# EAGLE board Keyboard (EAGLE 8.1.1), part 1 of 18
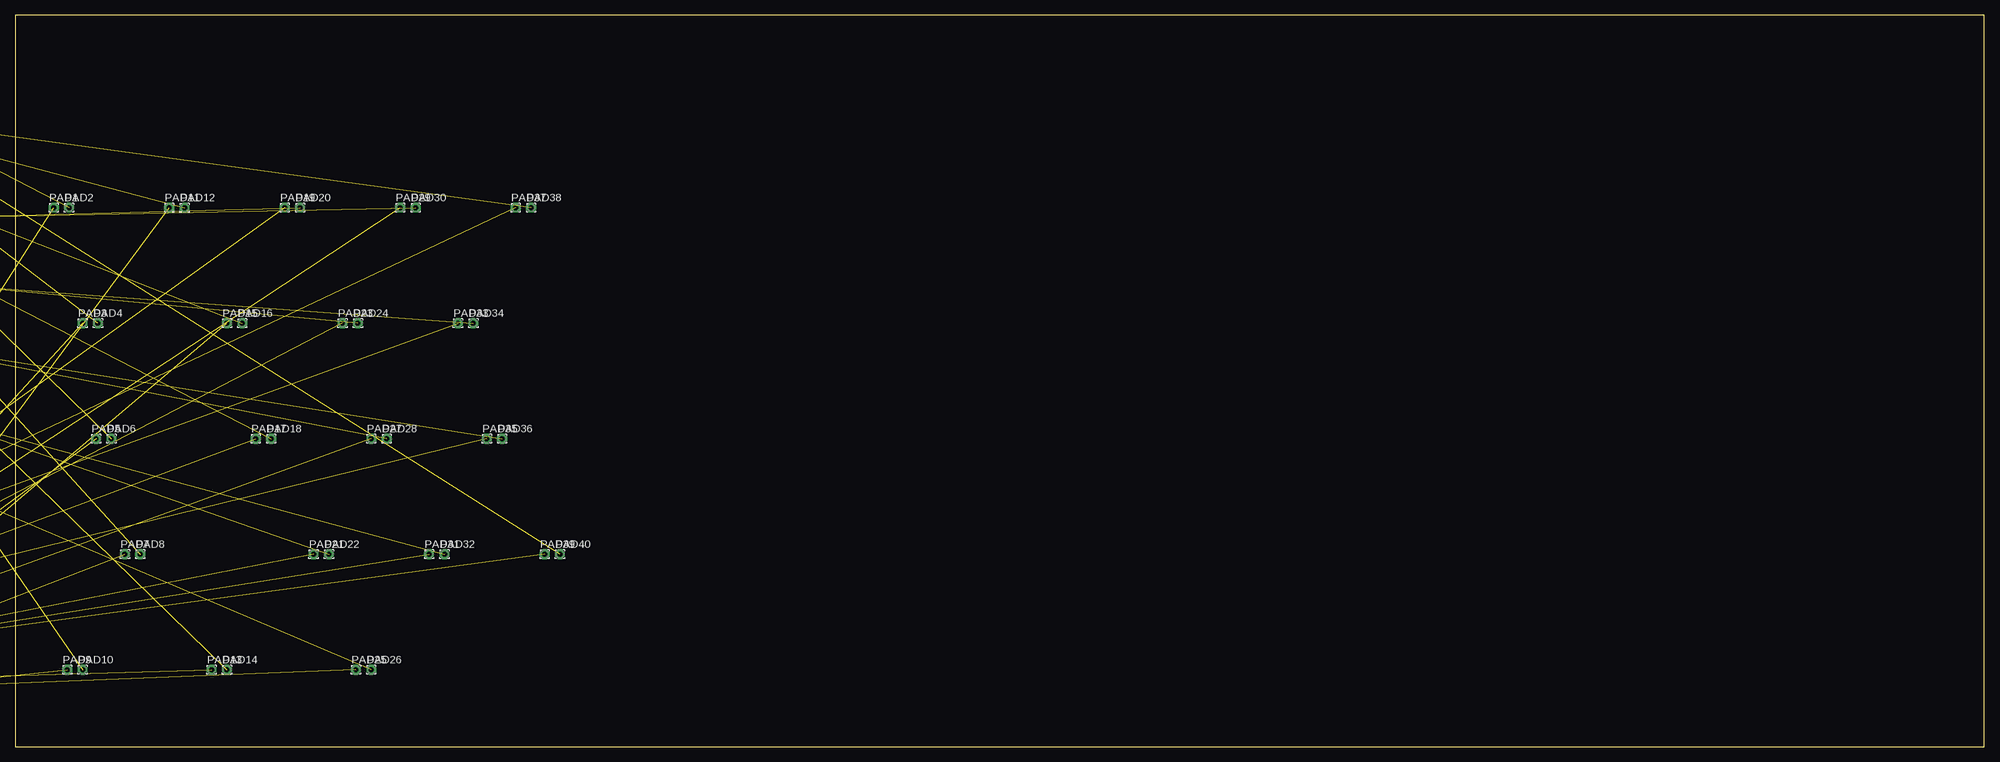
[diagram p5: board, top side]
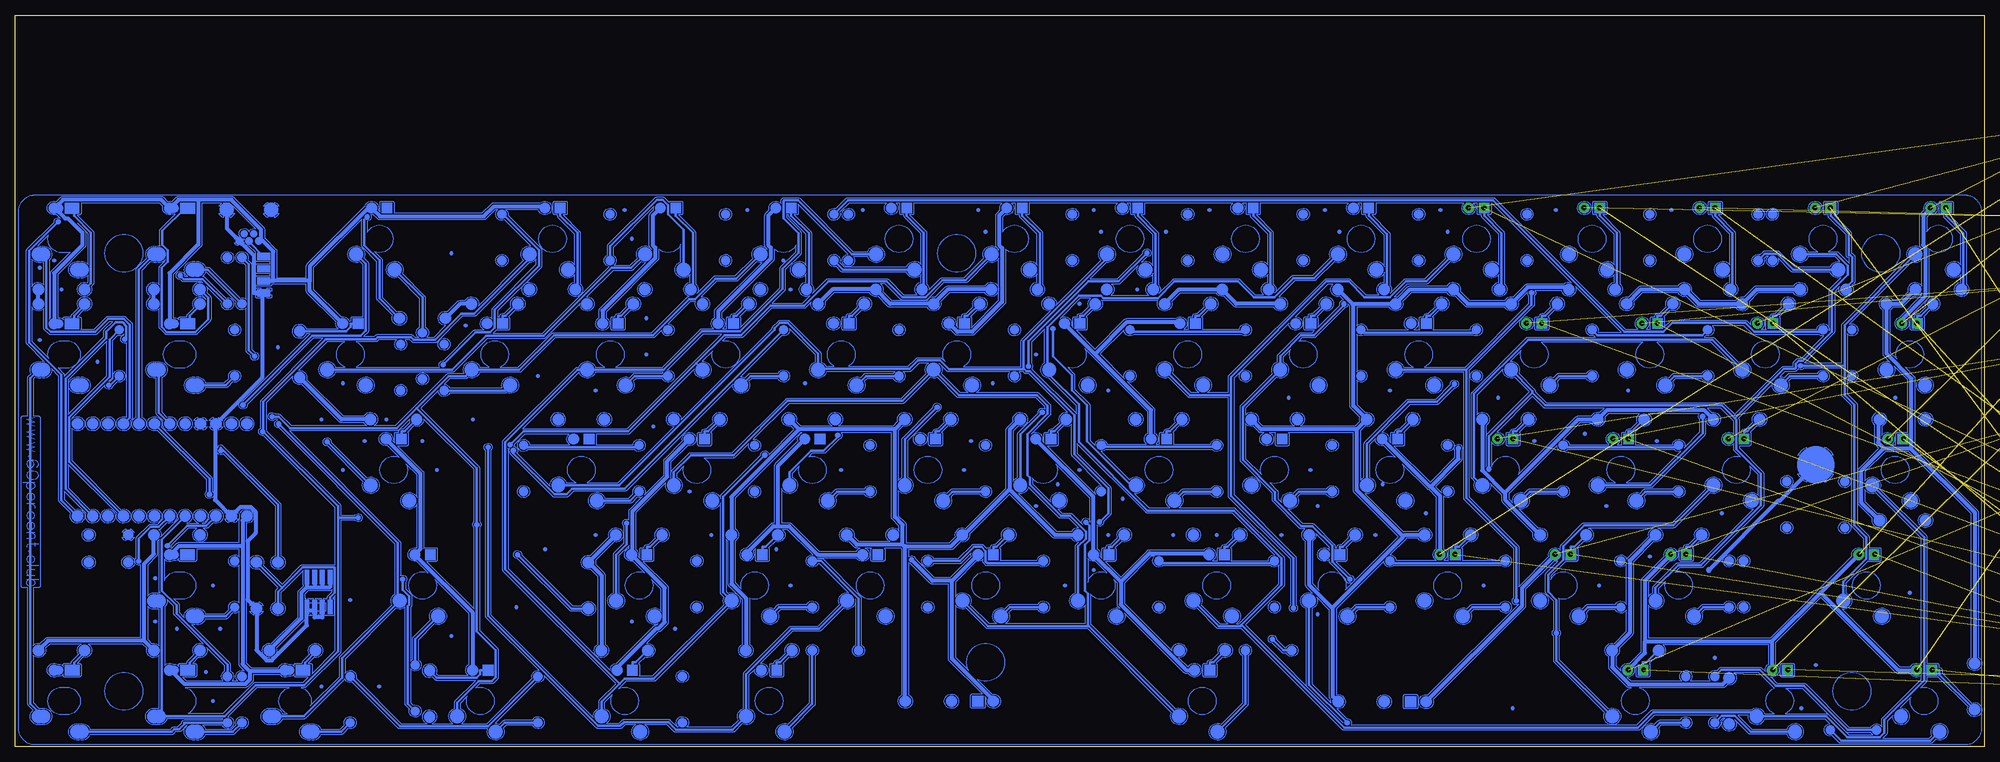
[diagram p6: board, bottom side, seen from below]

Size 324.79 x 120.64 mm. Coordinates in mm from the lower left corner, seen from the top.
Outline: 0,0 324.79,0 324.79,120.64 0,120.64 0,0
Copper layers (1*16): Top 0.035mm / dielectric 1.5mm / Bottom 0.035mm
Design rules "default": minimum track width 10mil, minimum drill 24mil, track to track 8mil, track to pad 8mil, pad to pad 8mil, via to via 8mil, smd to smd 8mil, copper to edge 40mil, drill to drill 8mil, minimum pad ring 10mil, minimum via ring 8mil, stop-mask expansion 4mil, vias tented up to drill 0mil, thermal gap 10mil

## Footprints (pad centres in the part's own frame; a part is rotated, then mirrored left to right if it is on the bottom)
2X5-SHROUDED = drill 1.016 pad 1.88: 1 -1.27,5.08; 2 1.27,5.08; 3 -1.27,2.54; 4 1.27,2.54; 5 -1.27,0; 6 1.27,0; 7 -1.27,-2.54; 8 1.27,-2.54; 9 -1.27,-5.08; 10 1.27,-5.08
1,6/0,8 = drill 0.813 pad 1.6 octagon: 1 0,0
R0805 = smd 1.3 x 1.5: 1 -0.95,0; 2 0.95,0
SOIC127P1030X265-20N = smd 1.981 x 0.559: 1 -4.674,5.715; 2 -4.674,4.445; 3 -4.674,3.175; 4 -4.674,1.905; 5 -4.674,0.635; 6 -4.674,-0.635; 7 -4.674,-1.905; 8 -4.674,-3.175; 9 -4.674,-4.445; 10 -4.674,-5.715; 11 4.674,-5.715; 12 4.674,-4.445; 13 4.674,-3.175; 14 4.674,-1.905; 15 4.674,-0.635; 16 4.674,0.635; 17 4.674,1.905; 18 4.674,3.175; 19 4.674,4.445; 20 4.674,5.715
SO14 = smd 0.6 x 1.2: 1 -3.81,-2.8; 2 -2.54,-2.8; 3 -1.27,-2.8; 4 0,-2.8; 5 1.27,-2.8; 6 2.54,-2.8; 7 3.81,-2.8; 8 3.81,2.8; 9 2.54,2.8; 10 1.27,2.8; 11 0,2.8; 12 -1.27,2.8; 13 -2.54,2.8; 14 -3.81,2.8
TEENSY_3.5/3.6 = drill 0.965: 0/RX -25.4,-7.62; 1/TX -22.86,-7.62; 2 -20.32,-7.62; 3/CANTX -17.78,-7.62; 3V3 7.62,-7.62; 3V3_2 17.78,-2.54; 3V3_LO -22.86,7.62; 4/CANRX -15.24,-7.62; 5 -12.7,-7.62; 6 -10.16,-7.62; 7 -7.62,-7.62; 8 -5.08,-7.62; 9/CS -2.54,-7.62; 10/CS 0,-7.62; 11/MOSI 2.54,-7.62; 12/MISO 5.08,-7.62; 13/SCK 5.08,7.62; 14/A0 2.54,7.62; 15/A1 0,7.62; 16/A2 -2.54,7.62; 17/A3 -5.08,7.62; 18/A4/SDA -7.62,7.62; 19/A5/SCL -10.16,7.62; 20/A6 -12.7,7.62; 21/A7 -15.24,7.62; 21/DAC0 12.7,7.62; 22/A8 -17.78,7.62; 23/A9 -20.32,7.62; 24 10.16,-7.62; 25 12.7,-7.62; 26 15.24,-7.62; 27 17.78,-7.62; 28 20.32,-7.62; 29 22.86,-7.62; 30 25.4,-7.62; 31/A12 27.94,-7.62; 32/A13 30.48,-7.62; 33/A14 30.48,7.62; 34/A15 27.94,7.62; 35/A16 25.4,7.62; 36/A17 22.86,7.62; 37/A18 20.32,7.62; 38/A19 17.78,7.62; 39/A20 15.24,7.62; A10 -17.78,5.08; A11 -15.24,5.08; A22/DAC1 10.16,7.62; AGND -25.4,7.62; AREF -20.32,5.08; GND -27.94,-7.62; GND2 7.62,7.62; GND3 17.78,0; PROG 17.78,2.54; RESET 17.78,5.08; U5V -21.59,-4.445; UD+ -16.51,-4.445; UD- -19.05,-4.445; UGND1 -13.97,-4.445; UGND2 -11.43,-4.445; VBAT 17.78,-5.08; VIN -27.94,7.62; VUSB -25.4,5.08

## Placement (x,y rotation side)
J1  [2X5-SHROUDED]  -17.78,11.43 0 top  (outside the outline)
PAD1  [1,6/0,8]  6.35,88.9 0 top
PAD2  [1,6/0,8]  8.89,88.9 0 top
PAD3  [1,6/0,8]  11.11,69.85 0 top
PAD4  [1,6/0,8]  13.65,69.85 0 top
PAD5  [1,6/0,8]  13.34,50.8 0 top
PAD6  [1,6/0,8]  15.88,50.8 0 top
PAD7  [1,6/0,8]  18.1,31.75 0 top
PAD8  [1,6/0,8]  20.64,31.75 0 top
PAD9  [1,6/0,8]  8.57,12.7 0 top
PAD10  [1,6/0,8]  11.11,12.7 0 top
PAD11  [1,6/0,8]  25.4,88.9 0 top
PAD12  [1,6/0,8]  27.94,88.9 0 top
PAD13  [1,6/0,8]  32.38,12.7 0 top
PAD14  [1,6/0,8]  34.92,12.7 0 top
PAD15  [1,6/0,8]  34.92,69.85 0 top
PAD16  [1,6/0,8]  37.47,69.85 0 top
PAD17  [1,6/0,8]  39.69,50.8 0 top
PAD18  [1,6/0,8]  42.23,50.8 0 top
PAD19  [1,6/0,8]  44.45,88.9 0 top
PAD20  [1,6/0,8]  46.99,88.9 0 top
PAD21  [1,6/0,8]  49.21,31.75 0 top
PAD22  [1,6/0,8]  51.75,31.75 0 top
PAD23  [1,6/0,8]  53.98,69.85 0 top
PAD24  [1,6/0,8]  56.52,69.85 0 top
PAD25  [1,6/0,8]  56.2,12.7 0 top
PAD26  [1,6/0,8]  58.74,12.7 0 top
PAD27  [1,6/0,8]  58.74,50.8 0 top
PAD28  [1,6/0,8]  61.28,50.8 0 top
PAD29  [1,6/0,8]  63.5,88.9 0 top
PAD30  [1,6/0,8]  66.04,88.9 0 top
PAD31  [1,6/0,8]  68.26,31.75 0 top
PAD32  [1,6/0,8]  70.8,31.75 0 top
PAD33  [1,6/0,8]  73.03,69.85 0 top
PAD34  [1,6/0,8]  75.56,69.85 0 top
PAD35  [1,6/0,8]  77.79,50.8 0 top
PAD36  [1,6/0,8]  80.33,50.8 0 top
PAD37  [1,6/0,8]  82.55,88.9 0 top
PAD38  [1,6/0,8]  85.09,88.9 0 top
PAD39  [1,6/0,8]  87.31,31.75 0 top
PAD40  [1,6/0,8]  89.85,31.75 0 top
PAD41  [1,6/0,8]  -93.98,129.54 0 top  (outside the outline)
PAD42  [1,6/0,8]  -100.33,129.54 0 top  (outside the outline)
PAD43  [1,6/0,8]  -106.68,129.54 0 top  (outside the outline)
PAD44  [1,6/0,8]  -113.03,129.54 0 top  (outside the outline)
PAD45  [1,6/0,8]  -119.38,129.54 0 top  (outside the outline)
PAD46  [1,6/0,8]  -125.73,129.54 0 top  (outside the outline)
PAD47  [1,6/0,8]  -132.08,129.54 0 top  (outside the outline)
PAD48  [1,6/0,8]  -17.78,133.35 0 top  (outside the outline)
PAD49  [1,6/0,8]  -24.13,133.35 0 top  (outside the outline)
PAD50  [1,6/0,8]  -30.48,133.35 0 top  (outside the outline)
PAD51  [1,6/0,8]  -36.83,133.35 0 top  (outside the outline)
PAD52  [1,6/0,8]  -43.18,133.35 0 top  (outside the outline)
PAD53  [1,6/0,8]  -49.53,133.35 0 top  (outside the outline)
PAD54  [1,6/0,8]  -55.88,133.35 0 top  (outside the outline)
PAD55  [1,6/0,8]  -62.23,133.35 0 top  (outside the outline)
PAD56  [1,6/0,8]  -68.58,133.35 0 top  (outside the outline)
PAD57  [1,6/0,8]  -74.93,133.35 0 top  (outside the outline)
PAD58  [1,6/0,8]  -81.28,133.35 0 top  (outside the outline)
PAD59  [1,6/0,8]  -87.63,133.35 0 top  (outside the outline)
PAD60  [1,6/0,8]  -93.98,133.35 0 top  (outside the outline)
PAD61  [1,6/0,8]  -100.33,133.35 0 top  (outside the outline)
PAD62  [1,6/0,8]  -106.68,133.35 0 top  (outside the outline)
PAD63  [1,6/0,8]  -113.03,133.35 0 top  (outside the outline)
PAD64  [1,6/0,8]  -119.38,133.35 0 top  (outside the outline)
PAD65  [1,6/0,8]  -125.73,133.35 0 top  (outside the outline)
PAD66  [1,6/0,8]  -132.08,133.35 0 top  (outside the outline)
PAD67  [1,6/0,8]  -17.78,137.16 0 top  (outside the outline)
PAD68  [1,6/0,8]  -24.13,137.16 0 top  (outside the outline)
PAD69  [1,6/0,8]  -30.48,137.16 0 top  (outside the outline)
PAD70  [1,6/0,8]  -36.83,137.16 0 top  (outside the outline)
PAD71  [1,6/0,8]  -43.18,137.16 0 top  (outside the outline)
PAD72  [1,6/0,8]  -49.53,137.16 0 top  (outside the outline)
PAD73  [1,6/0,8]  -55.88,137.16 0 top  (outside the outline)
PAD74  [1,6/0,8]  -62.23,137.16 0 top  (outside the outline)
PAD75  [1,6/0,8]  -68.58,137.16 0 top  (outside the outline)
PAD76  [1,6/0,8]  -74.93,137.16 0 top  (outside the outline)
PAD77  [1,6/0,8]  -81.28,137.16 0 top  (outside the outline)
PAD78  [1,6/0,8]  -87.63,137.16 0 top  (outside the outline)
PAD79  [1,6/0,8]  -93.98,137.16 0 top  (outside the outline)
PAD80  [1,6/0,8]  -100.33,137.16 0 top  (outside the outline)
PAD81  [1,6/0,8]  -106.68,137.16 0 top  (outside the outline)
PAD82  [1,6/0,8]  -113.03,137.16 0 top  (outside the outline)
PAD83  [1,6/0,8]  -119.38,137.16 0 top  (outside the outline)
PAD84  [1,6/0,8]  -125.73,137.16 0 top  (outside the outline)
PAD85  [1,6/0,8]  -132.08,137.16 0 top  (outside the outline)
PAD86  [1,6/0,8]  -17.78,140.97 0 top  (outside the outline)
PAD87  [1,6/0,8]  -24.13,140.97 0 top  (outside the outline)
PAD88  [1,6/0,8]  -30.48,140.97 0 top  (outside the outline)
PAD89  [1,6/0,8]  -36.83,140.97 0 top  (outside the outline)
PAD90  [1,6/0,8]  -43.18,140.97 0 top  (outside the outline)
PAD91  [1,6/0,8]  -49.53,140.97 0 top  (outside the outline)
PAD92  [1,6/0,8]  -55.88,140.97 0 top  (outside the outline)
PAD93  [1,6/0,8]  -62.23,140.97 0 top  (outside the outline)
PAD94  [1,6/0,8]  -68.58,140.97 0 top  (outside the outline)
PAD95  [1,6/0,8]  -74.93,140.97 0 top  (outside the outline)
PAD96  [1,6/0,8]  -81.28,140.97 0 top  (outside the outline)
PAD97  [1,6/0,8]  -87.63,140.97 0 top  (outside the outline)
PAD98  [1,6/0,8]  -93.98,140.97 0 top  (outside the outline)
PAD99  [1,6/0,8]  -100.33,140.97 0 top  (outside the outline)
PAD100  [1,6/0,8]  -86.36,113.03 0 top  (outside the outline)
PAD101  [1,6/0,8]  -93.98,113.03 0 top  (outside the outline)
PAD102  [1,6/0,8]  -101.6,113.03 0 top  (outside the outline)
PAD103  [1,6/0,8]  -109.22,113.03 0 top  (outside the outline)
PAD104  [1,6/0,8]  -116.84,113.03 0 top  (outside the outline)
PAD105  [1,6/0,8]  -124.46,113.03 0 top  (outside the outline)
PAD106  [1,6/0,8]  -132.08,113.03 0 top  (outside the outline)
PAD107  [1,6/0,8]  -19.05,118.11 0 top  (outside the outline)
PAD108  [1,6/0,8]  -26.67,118.11 0 top  (outside the outline)
PAD109  [1,6/0,8]  -34.29,118.11 0 top  (outside the outline)
PAD110  [1,6/0,8]  -41.91,118.11 0 top  (outside the outline)
PAD111  [1,6/0,8]  -49.53,118.11 0 top  (outside the outline)
PAD112  [1,6/0,8]  -57.15,118.11 0 top  (outside the outline)
PAD113  [1,6/0,8]  -64.77,118.11 0 top  (outside the outline)
PAD114  [1,6/0,8]  -72.39,118.11 0 top  (outside the outline)
PAD115  [1,6/0,8]  -80.01,118.11 0 top  (outside the outline)
PAD116  [1,6/0,8]  -87.63,118.11 0 top  (outside the outline)
PAD117  [1,6/0,8]  -95.25,118.11 0 top  (outside the outline)
PAD118  [1,6/0,8]  -102.87,118.11 0 top  (outside the outline)
PAD119  [1,6/0,8]  -110.49,118.11 0 top  (outside the outline)
PAD120  [1,6/0,8]  -118.11,118.11 0 top  (outside the outline)
PAD121  [1,6/0,8]  -125.73,118.11 0 top  (outside the outline)
PAD122  [1,6/0,8]  -133.35,118.11 0 top  (outside the outline)
PAD123  [1,6/0,8]  -19.05,121.92 0 top  (outside the outline)
PAD124  [1,6/0,8]  -26.67,121.92 0 top  (outside the outline)
PAD125  [1,6/0,8]  -34.29,121.92 0 top  (outside the outline)
PAD126  [1,6/0,8]  -41.91,121.92 0 top  (outside the outline)
PAD127  [1,6/0,8]  -49.53,121.92 0 top  (outside the outline)
PAD128  [1,6/0,8]  -57.15,121.92 0 top  (outside the outline)
PAD129  [1,6/0,8]  -64.77,121.92 0 top  (outside the outline)
PAD130  [1,6/0,8]  -72.39,121.92 0 top  (outside the outline)
PAD131  [1,6/0,8]  -80.01,121.92 0 top  (outside the outline)
PAD132  [1,6/0,8]  -87.63,121.92 0 top  (outside the outline)
PAD133  [1,6/0,8]  -95.25,121.92 0 top  (outside the outline)
PAD134  [1,6/0,8]  -102.87,121.92 0 top  (outside the outline)
PAD135  [1,6/0,8]  -110.49,121.92 0 top  (outside the outline)
PAD136  [1,6/0,8]  -118.11,121.92 0 top  (outside the outline)
PAD137  [1,6/0,8]  -125.73,121.92 0 top  (outside the outline)
PAD138  [1,6/0,8]  -133.35,121.92 0 top  (outside the outline)
R1  [R0805]  -36.83,113.03 0 top  (outside the outline)
R2  [R0805]  -41.91,113.03 0 top  (outside the outline)
R3  [R0805]  -46.99,113.03 0 top  (outside the outline)
R4  [R0805]  -52.07,113.03 0 top  (outside the outline)
R5  [R0805]  -57.15,113.03 0 top  (outside the outline)
R5V  [R0805]  -90.17,85.09 0 top  (outside the outline)
R6  [R0805]  -62.23,113.03 0 top  (outside the outline)
R7  [R0805]  -67.31,113.03 0 top  (outside the outline)
R8  [R0805]  -72.39,113.03 0 top  (outside the outline)
R9  [R0805]  -77.47,113.03 0 top  (outside the outline)
R10  [R0805]  -95.25,85.09 0 top  (outside the outline)
R11  [R0805]  -100.33,85.09 0 top  (outside the outline)
R12  [R0805]  -105.41,85.09 0 top  (outside the outline)
R13  [R0805]  -110.49,85.09 0 top  (outside the outline)
R14  [R0805]  -115.57,85.09 0 top  (outside the outline)
R15  [R0805]  -120.65,85.09 0 top  (outside the outline)
R16  [R0805]  -125.73,85.09 0 top  (outside the outline)
R17  [R0805]  -130.81,85.09 0 top  (outside the outline)
R18  [R0805]  -135.89,85.09 0 top  (outside the outline)
R19  [R0805]  -16.51,102.87 0 top  (outside the outline)
R20  [R0805]  -21.59,102.87 0 top  (outside the outline)
R21  [R0805]  -26.67,102.87 0 top  (outside the outline)
R22  [R0805]  -31.75,102.87 0 top  (outside the outline)
R23  [R0805]  -36.83,102.87 0 top  (outside the outline)
R24  [R0805]  -41.91,102.87 0 top  (outside the outline)
R25  [R0805]  -46.99,102.87 0 top  (outside the outline)
R26  [R0805]  -52.07,102.87 0 top  (outside the outline)
R27  [R0805]  -57.15,102.87 0 top  (outside the outline)
R28  [R0805]  -62.23,102.87 0 top  (outside the outline)
R29  [R0805]  -67.31,102.87 0 top  (outside the outline)
R30  [R0805]  -72.39,102.87 0 top  (outside the outline)
R31  [R0805]  -77.47,102.87 0 top  (outside the outline)
R32  [R0805]  -82.55,102.87 0 top  (outside the outline)
R33  [R0805]  -87.63,102.87 0 top  (outside the outline)
R34  [R0805]  -92.71,102.87 0 top  (outside the outline)
R35  [R0805]  -97.79,102.87 0 top  (outside the outline)
R36  [R0805]  -102.87,102.87 0 top  (outside the outline)
R37  [R0805]  -107.95,102.87 0 top  (outside the outline)
R38  [R0805]  -113.03,102.87 0 top  (outside the outline)
R39  [R0805]  -118.11,102.87 0 top  (outside the outline)
R40  [R0805]  -123.19,102.87 0 top  (outside the outline)
R41  [R0805]  -128.27,102.87 0 top  (outside the outline)
R42  [R0805]  -133.35,102.87 0 top  (outside the outline)
R43  [R0805]  -16.51,107.95 0 top  (outside the outline)
R44  [R0805]  -21.59,107.95 0 top  (outside the outline)
R45  [R0805]  -26.67,107.95 0 top  (outside the outline)
R46  [R0805]  -31.75,107.95 0 top  (outside the outline)
R47  [R0805]  -36.83,107.95 0 top  (outside the outline)
R48  [R0805]  -41.91,107.95 0 top  (outside the outline)
R49  [R0805]  -46.99,107.95 0 top  (outside the outline)
R50  [R0805]  -52.07,107.95 0 top  (outside the outline)
R51  [R0805]  -57.15,107.95 0 top  (outside the outline)
R52  [R0805]  -62.23,107.95 0 top  (outside the outline)
R53  [R0805]  -67.31,107.95 0 top  (outside the outline)
R54  [R0805]  -72.39,107.95 0 top  (outside the outline)
R55  [R0805]  -77.47,107.95 0 top  (outside the outline)
R56  [R0805]  -82.55,107.95 0 top  (outside the outline)
R57  [R0805]  -87.63,107.95 0 top  (outside the outline)
R58  [R0805]  -92.71,107.95 0 top  (outside the outline)
R59  [R0805]  -97.79,107.95 0 top  (outside the outline)
R60  [R0805]  -102.87,107.95 0 top  (outside the outline)
R61  [R0805]  -107.95,107.95 0 top  (outside the outline)
R62  [R0805]  -113.03,107.95 0 top  (outside the outline)
R63  [R0805]  -118.11,107.95 0 top  (outside the outline)
R64  [R0805]  -123.19,107.95 0 top  (outside the outline)
R65  [R0805]  -128.27,107.95 0 top  (outside the outline)
R66  [R0805]  -133.35,107.95 0 top  (outside the outline)
R67  [R0805]  -16.51,113.03 0 top  (outside the outline)
R68  [R0805]  -21.59,113.03 0 top  (outside the outline)
R69  [R0805]  -26.67,113.03 0 top  (outside the outline)
RG  [R0805]  -31.75,113.03 0 top  (outside the outline)
U1  TPIC6B595DW  [SOIC127P1030X265-20N]  -38.1,10.16 0 top  (outside the outline)
U2  TPIC6B595DW  [SOIC127P1030X265-20N]  -59.69,10.16 0 top  (outside the outline)
U3  TPIC6B595DW  [SOIC127P1030X265-20N]  -81.28,10.16 0 top  (outside the outline)
U4  TPIC6B595DW  [SOIC127P1030X265-20N]  -102.87,10.16 0 top  (outside the outline)
U5  TPIC6B595DW  [SOIC127P1030X265-20N]  -124.46,10.16 0 top  (outside the outline)
U6  TPIC6B595DW  [SOIC127P1030X265-20N]  -27.94,33.02 0 top  (outside the outline)
U7  TPIC6B595DW  [SOIC127P1030X265-20N]  -49.53,33.02 0 top  (outside the outline)
U8  TPIC6B595DW  [SOIC127P1030X265-20N]  -71.12,33.02 0 top  (outside the outline)
U9  TPIC6B595DW  [SOIC127P1030X265-20N]  -92.71,33.02 0 top  (outside the outline)
U10  TPIC6B595DW  [SOIC127P1030X265-20N]  -114.3,33.02 0 top  (outside the outline)
U11  TPIC6B595DW  [SOIC127P1030X265-20N]  -27.94,53.34 0 top  (outside the outline)
U12  TPIC6B595DW  [SOIC127P1030X265-20N]  -49.53,53.34 0 top  (outside the outline)
U13  TPIC6B595DW  [SOIC127P1030X265-20N]  -71.12,53.34 0 top  (outside the outline)
U14  TPIC6B595DW  [SOIC127P1030X265-20N]  -92.71,53.34 0 top  (outside the outline)
U15  TPIC6B595DW  [SOIC127P1030X265-20N]  -114.3,53.34 0 top  (outside the outline)
U16  TPIC6B595DW  [SOIC127P1030X265-20N]  -27.94,73.66 0 top  (outside the outline)
U17  TPIC6B595DW  [SOIC127P1030X265-20N]  -49.53,73.66 0 top  (outside the outline)
U18  TPIC6B595DW  [SOIC127P1030X265-20N]  -71.12,73.66 0 top  (outside the outline)
U19  [SO14]  -81.28,87.63 0 top  (outside the outline)
U$59  TEENSY_3.5/3.6  [TEENSY_3.5/3.6]  -45.72,92.71 0 top  (outside the outline)

## Tracks (layer width: path | path; a pad name or v marks a point on that pad's centre or on a via)
N$1  (1 unrouted)
N$2  (1 unrouted)
N$3  (36 unrouted)
N$4  (1 unrouted)
N$5  (1 unrouted)
N$6  (1 unrouted)
N$7  (1 unrouted)
N$8  (1 unrouted)
N$9  (1 unrouted)
N$10  (1 unrouted)
N$11  (1 unrouted)
N$12  (18 unrouted)
N$13  (1 unrouted)
N$14  (1 unrouted)
N$15  (1 unrouted)
N$16  (1 unrouted)
N$17  (1 unrouted)
N$18  (1 unrouted)
N$19  (1 unrouted)
N$20  (1 unrouted)
N$21  (1 unrouted)
N$22  (1 unrouted)
N$23  (1 unrouted)
N$24  (1 unrouted)
N$25  (1 unrouted)
N$26  (1 unrouted)
N$27  (1 unrouted)
N$28  (1 unrouted)
N$29  (1 unrouted)
N$30  (1 unrouted)
N$31  (1 unrouted)
N$32  (1 unrouted)
N$33  (1 unrouted)
N$34  (1 unrouted)
N$35  (1 unrouted)
N$36  (1 unrouted)
N$37  (1 unrouted)
N$38  (1 unrouted)
N$39  (1 unrouted)
N$40  (1 unrouted)
N$41  (1 unrouted)
N$42  (1 unrouted)
N$43  (1 unrouted)
N$44  (1 unrouted)
N$45  (1 unrouted)
N$46  (1 unrouted)
N$47  (1 unrouted)
N$48  (1 unrouted)
N$49  (1 unrouted)
N$50  (1 unrouted)
N$51  (1 unrouted)
N$52  (1 unrouted)
N$53  (1 unrouted)
N$54  (1 unrouted)
N$55  (1 unrouted)
N$56  (1 unrouted)
N$57  (1 unrouted)
N$58  (1 unrouted)
N$59  (1 unrouted)
N$60  (1 unrouted)
N$61  (20 unrouted)
N$62  (1 unrouted)
N$63  (19 unrouted)
N$64  (1 unrouted)
N$65  (1 unrouted)
N$66  (1 unrouted)
N$67  (1 unrouted)
N$68  (1 unrouted)
N$69  (1 unrouted)
N$70  (1 unrouted)
N$71  (1 unrouted)
N$72  (1 unrouted)
N$73  (1 unrouted)
N$74  (1 unrouted)
N$75  (1 unrouted)
N$76  (1 unrouted)
N$77  (1 unrouted)
N$78  (1 unrouted)
N$79  (1 unrouted)
N$80  (1 unrouted)
N$81  (1 unrouted)
N$82  (1 unrouted)
N$83  (1 unrouted)
N$84  (1 unrouted)
N$85  (1 unrouted)
N$86  (1 unrouted)
N$87  (1 unrouted)
N$88  (1 unrouted)
N$89  (1 unrouted)
N$90  (1 unrouted)
N$91  (1 unrouted)
N$92  (1 unrouted)
N$93  (1 unrouted)
N$94  (1 unrouted)
N$95  (56 unrouted)
N$96  (1 unrouted)
N$97  (1 unrouted)
N$98  (1 unrouted)
N$99  (1 unrouted)
N$100  (1 unrouted)
N$101  (1 unrouted)
N$102  (1 unrouted)
N$103  (1 unrouted)
N$104  (1 unrouted)
N$105  (1 unrouted)
N$106  (1 unrouted)
N$107  (1 unrouted)
N$108  (1 unrouted)
N$109  (1 unrouted)
N$110  (1 unrouted)
N$111  (1 unrouted)
N$112  (1 unrouted)
N$113  (1 unrouted)
N$114  (1 unrouted)
N$115  (1 unrouted)
N$116  (1 unrouted)
N$117  (1 unrouted)
N$118  (1 unrouted)
N$119  (1 unrouted)
N$120  (1 unrouted)
N$121  (1 unrouted)
N$122  (1 unrouted)
N$123  (1 unrouted)
N$124  (1 unrouted)
N$125  (1 unrouted)
N$126  (1 unrouted)
N$127  (1 unrouted)
N$128  (1 unrouted)
N$129  (1 unrouted)
N$130  (1 unrouted)
N$131  (1 unrouted)
N$132  (1 unrouted)
N$133  (1 unrouted)
N$134  (1 unrouted)
N$135  (1 unrouted)
N$136  (1 unrouted)
N$137  (1 unrouted)
N$138  (1 unrouted)
N$139  (1 unrouted)
N$140  (1 unrouted)
N$141  (1 unrouted)
N$142  (1 unrouted)
N$143  (1 unrouted)
N$144  (1 unrouted)
N$145  (1 unrouted)
N$146  (1 unrouted)
N$147  (1 unrouted)
N$148  (1 unrouted)
N$149  (1 unrouted)
N$150  (1 unrouted)
N$151  (1 unrouted)
N$152  (1 unrouted)
N$153  (1 unrouted)
N$154  (1 unrouted)
N$155  (1 unrouted)
N$156  (1 unrouted)
N$157  (1 unrouted)
N$158  (1 unrouted)
N$159  (1 unrouted)
N$160  (1 unrouted)
N$161  (1 unrouted)
N$162  (1 unrouted)
N$163  (1 unrouted)
N$164  (1 unrouted)
N$165  (1 unrouted)
N$166  (1 unrouted)
N$167  (1 unrouted)
N$168  (1 unrouted)
N$169  (1 unrouted)
N$170  (1 unrouted)
N$171  (1 unrouted)
N$172  (1 unrouted)
N$173  (1 unrouted)
N$174  (1 unrouted)
N$175  (1 unrouted)
N$176  (1 unrouted)
N$177  (1 unrouted)
N$178  (1 unrouted)
N$179  (1 unrouted)
N$180  (1 unrouted)
N$181  (1 unrouted)
N$182  (1 unrouted)
N$183  (1 unrouted)
N$184  (1 unrouted)
N$185  (1 unrouted)
N$186  (1 unrouted)
N$187  (1 unrouted)
N$188  (1 unrouted)
N$189  (1 unrouted)
N$190  (1 unrouted)
N$191  (1 unrouted)
N$192  (1 unrouted)
N$193  (1 unrouted)
N$194  (1 unrouted)
N$195  (1 unrouted)
N$196  (1 unrouted)
N$197  (1 unrouted)
N$198  (1 unrouted)
N$199  (1 unrouted)
N$200  (1 unrouted)
N$201  (1 unrouted)
N$202  (1 unrouted)
N$203  (1 unrouted)
N$204  (1 unrouted)
N$205  (1 unrouted)
N$206  (1 unrouted)
N$207  (1 unrouted)
N$208  (1 unrouted)
N$209  (1 unrouted)
N$210  (1 unrouted)
N$211  (1 unrouted)
N$212  (1 unrouted)
N$213  (1 unrouted)
N$214  (1 unrouted)
N$215  (1 unrouted)
N$216  (1 unrouted)
N$217  (1 unrouted)
N$218  (1 unrouted)
N$219  (1 unrouted)
N$220  (1 unrouted)
N$221  (1 unrouted)
N$222  (1 unrouted)
N$223  (1 unrouted)
N$224  (1 unrouted)
N$225  (1 unrouted)
N$226  (1 unrouted)
N$227  (1 unrouted)
N$228  (1 unrouted)
N$229  (1 unrouted)
N$230  (1 unrouted)
N$231  (1 unrouted)
N$232  (1 unrouted)
N$233  (1 unrouted)
N$234  (1 unrouted)
N$235  (1 unrouted)
N$236  (1 unrouted)
N$237  (1 unrouted)
N$238  (1 unrouted)
N$239  (1 unrouted)
N$240  (1 unrouted)
N$241  (1 unrouted)
N$242  (1 unrouted)
N$243  (1 unrouted)
N$244  (1 unrouted)
S$1
  Bottom 0: 2.79,0.4 2.62,0.44
S$2
  Bottom 0: 2.62,0.44 2.44,0.48
S$3
  Bottom 0: 2.44,0.48 2.27,0.54
S$4
  Bottom 0: 2.27,0.54 2.11,0.6
S$5
  Bottom 0: 2.11,0.6 1.94,0.68
S$6
  Bottom 0: 1.94,0.68 1.78,0.77
S$7
  Bottom 0: 1.78,0.77 1.63,0.86
S$8
  Bottom 0: 1.63,0.86 1.49,0.97
S$9
  Bottom 0: 1.49,0.97 1.35,1.08
S$10
  Bottom 0: 1.35,1.08 1.22,1.2
S$11
  Bottom 0: 1.22,1.2 1.09,1.33
S$12
  Bottom 0: 1.09,1.33 0.98,1.47
S$13
  Bottom 0: 0.98,1.47 0.87,1.62
S$14
  Bottom 0: 0.87,1.62 0.78,1.76
S$15
  Bottom 0: 0.78,1.76 0.69,1.92
S$16
  Bottom 0: 0.69,1.92 0.62,2.08
S$17
  Bottom 0: 0.62,2.08 0.55,2.25
S$18
  Bottom 0: 0.55,2.25 0.49,2.43
S$19
  Bottom 0: 0.49,2.43 0.45,2.6
S$20
  Bottom 0: 0.45,2.6 0.41,2.77
S$21
  Bottom 0: 0.41,2.77 0.41,2.8
S$22
  Bottom 0: 0.41,2.8 0.41,87.33
S$23
  Bottom 0: 0.41,87.33 0.41,88.52
S$24
  Bottom 0: 0.41,88.52 0.45,88.69
S$25
  Bottom 0: 0.45,88.69 0.49,88.87
S$26
  Bottom 0: 0.49,88.87 0.54,89.04
S$27
  Bottom 0: 0.54,89.04 0.61,89.21
S$28
  Bottom 0: 0.61,89.21 0.69,89.37
S$29
  Bottom 0: 0.69,89.37 0.77,89.53
S$30
  Bottom 0: 0.77,89.53 0.87,89.68
S$31
  Bottom 0: 0.87,89.68 0.97,89.82
S$32
  Bottom 0: 0.97,89.82 1.08,89.96
S$33
  Bottom 0: 1.08,89.96 1.21,90.09
S$34
  Bottom 0: 1.21,90.09 1.34,90.21
S$35
  Bottom 0: 1.34,90.21 1.48,90.33
S$36
  Bottom 0: 1.48,90.33 1.62,90.44
S$37
  Bottom 0: 1.62,90.44 1.77,90.53
S$38
  Bottom 0: 1.77,90.53 1.93,90.62
S$39
  Bottom 0: 1.93,90.62 2.09,90.7
S$40
  Bottom 0: 2.09,90.7 2.26,90.76
S$41
  Bottom 0: 2.26,90.76 2.43,90.82
S$42
  Bottom 0: 2.43,90.82 2.6,90.86
S$43
  Bottom 0: 2.6,90.86 2.78,90.9
S$44
  Bottom 0: 2.78,90.9 2.79,90.9
S$45
  Bottom 0: 2.79,90.9
S$46
  Bottom 0: 2.79,90.9 321.91,90.9
S$47
  Bottom 0: 321.91,90.9
S$48
  Bottom 0: 321.91,90.9 322.09,90.87
S$49
  Bottom 0: 322.09,90.87 322.26,90.82
S$50
  Bottom 0: 322.26,90.82 322.44,90.77
S$51
  Bottom 0: 322.44,90.77 322.6,90.7
S$52
  Bottom 0: 322.6,90.7 322.76,90.62
S$53
  Bottom 0: 322.76,90.62 322.92,90.54
S$54
  Bottom 0: 322.92,90.54 323.07,90.45
S$55
  Bottom 0: 323.07,90.45 323.22,90.34
S$56
  Bottom 0: 323.22,90.34 323.36,90.23
S$57
  Bottom 0: 323.36,90.23 323.49,90.1
S$58
  Bottom 0: 323.49,90.1 323.61,89.97
S$59
  Bottom 0: 323.61,89.97 323.73,89.84
S$60
  Bottom 0: 323.73,89.84 323.83,89.69
S$61
  Bottom 0: 323.83,89.69 323.93,89.54
S$62
  Bottom 0: 323.93,89.54 324.01,89.38
S$63
  Bottom 0: 324.01,89.38 324.09,89.22
S$64
  Bottom 0: 324.09,89.22 324.16,89.06
S$65
  Bottom 0: 324.16,89.06 324.21,88.88
S$66
  Bottom 0: 324.21,88.88 324.26,88.71
S$67
  Bottom 0: 324.26,88.71 324.3,88.54
S$68
  Bottom 0: 324.3,88.54 324.3,2.79
S$69
  Bottom 0: 324.3,2.79 324.26,2.61
S$70
  Bottom 0: 324.26,2.61 324.22,2.44
S$71
  Bottom 0: 324.22,2.44 324.16,2.27
S$72
  Bottom 0: 324.16,2.27 324.1,2.1
S$73
  Bottom 0: 324.1,2.1 324.02,1.94
S$74
  Bottom 0: 324.02,1.94 323.94,1.78
S$75
  Bottom 0: 323.94,1.78 323.84,1.63
S$76
  Bottom 0: 323.84,1.63 323.74,1.48
S$77
  Bottom 0: 323.74,1.48 323.62,1.34
S$78
  Bottom 0: 323.62,1.34 323.49,1.21
S$79
  Bottom 0: 323.49,1.21 323.37,1.09
S$80
  Bottom 0: 323.37,1.09 323.23,0.98
S$81
  Bottom 0: 323.23,0.98 323.08,0.87
S$82
  Bottom 0: 323.08,0.87 322.93,0.78
S$83
  Bottom 0: 322.93,0.78 322.78,0.69
S$84
  Bottom 0: 322.78,0.69 322.62,0.61
S$85
  Bottom 0: 322.62,0.61 322.45,0.54
S$86
  Bottom 0: 322.45,0.54 322.28,0.48
S$87
  Bottom 0: 322.28,0.48 322.11,0.44
S$88
  Bottom 0: 322.11,0.44 321.93,0.41
S$89
  Bottom 0: 321.93,0.41 321.91,0.4
S$90
  Bottom 0: 321.91,0.4 2.79,0.4
S$91
  Bottom 0: 8.88,0.55 23.62,0.55
S$92
  Bottom 0: 23.62,0.55 23.69,0.55
S$93
  Bottom 0: 23.69,0.55 23.75,0.57
S$94
  Bottom 0: 23.75,0.57 23.82,0.59
S$95
  Bottom 0: 23.82,0.59 23.88,0.63
S$96
  Bottom 0: 23.88,0.63 23.93,0.67
S$97
  Bottom 0: 23.93,0.67 25.09,1.83
S$98
  Bottom 0: 25.09,1.83 25.19,1.8
S$99
  Bottom 0: 25.19,1.8 25.49,1.77
S$100
  Bottom 0: 25.49,1.77 25.79,1.84
S$101
  Bottom 0: 25.79,1.84 26.05,1.99
S$102
  Bottom 0: 26.05,1.99 26.26,2.21
S$103
  Bottom 0: 26.26,2.21 26.39,2.49
S$104
  Bottom 0: 26.39,2.49 26.43,2.79
S$105
  Bottom 0: 26.43,2.79 26.39,3.09
S$106
  Bottom 0: 26.39,3.09 26.26,3.36
S$107
  Bottom 0: 26.26,3.36 26.05,3.58
S$108
  Bottom 0: 26.05,3.58 25.79,3.73
S$109
  Bottom 0: 25.79,3.73 25.49,3.8
S$110
  Bottom 0: 25.49,3.8 25.46,3.79
S$111
  Bottom 0: 25.46,3.79 26.24,4.58
S$112
  Bottom 0: 26.24,4.58 36.24,4.58
S$113
  Bottom 0: 36.24,4.58 36.26,4.5
S$114
  Bottom 0: 36.26,4.5 36.43,4.19
S$115
  Bottom 0: 36.43,4.19 36.67,3.94
S$116
  Bottom 0: 36.67,3.94 36.96,3.75
S$117
  Bottom 0: 36.96,3.75 37.3,3.65
S$118
  Bottom 0: 37.3,3.65 37.65,3.62
S$119
  Bottom 0: 37.65,3.62 37.99,3.69
S$120
  Bottom 0: 37.99,3.69 38.3,3.84
S$121
  Bottom 0: 38.3,3.84 38.58,4.06
S$122
  Bottom 0: 38.58,4.06 38.78,4.35
S$123
  Bottom 0: 38.78,4.35 38.91,4.67
S$124
  Bottom 0: 38.91,4.67 38.96,5.02
S$125
  Bottom 0: 38.96,5.02 38.92,5.23
S$126
  Bottom 0: 38.92,5.23 40.66,5.23
S$127
  Bottom 0: 40.66,5.23 38.35,2.92
S$128
  Bottom 0: 38.35,2.92 32.52,2.92
S$129
  Bottom 0: 32.52,2.92 32.43,3.15
S$130
  Bottom 0: 32.43,3.15 32.23,3.43
S$131
  Bottom 0: 32.23,3.43 31.96,3.65
S$132
  Bottom 0: 31.96,3.65 31.64,3.81
S$133
  Bottom 0: 31.64,3.81 31.29,3.87
S$134
  Bottom 0: 31.29,3.87 30.94,3.85
S$135
  Bottom 0: 30.94,3.85 30.61,3.74
S$136
  Bottom 0: 30.61,3.74 30.32,3.55
S$137
  Bottom 0: 30.32,3.55 30.08,3.3
S$138
  Bottom 0: 30.08,3.3 29.91,2.99
S$139
  Bottom 0: 29.91,2.99 29.82,2.65
S$140
  Bottom 0: 29.82,2.65 29.82,2.3
S$141
  Bottom 0: 29.82,2.3 29.91,1.96
S$142
  Bottom 0: 29.91,1.96 30.08,1.65
S$143
  Bottom 0: 30.08,1.65 30.32,1.4
S$144
  Bottom 0: 30.32,1.4 30.61,1.21
S$145
  Bottom 0: 30.61,1.21 30.94,1.1
S$146
  Bottom 0: 30.94,1.1 31.29,1.08
S$147
  Bottom 0: 31.29,1.08 31.64,1.15
S$148
  Bottom 0: 31.64,1.15 31.96,1.3
S$149
  Bottom 0: 31.96,1.3 32.23,1.52
S$150
  Bottom 0: 32.23,1.52 32.43,1.81
S$151
  Bottom 0: 32.43,1.81 32.52,2.04
S$152
  Bottom 0: 32.52,2.04 38.53,2.04
S$153
  Bottom 0: 38.53,2.04 38.6,2.04
S$154
  Bottom 0: 38.6,2.04 38.67,2.06
S$155
  Bottom 0: 38.67,2.06 38.73,2.08
S$156
  Bottom 0: 38.73,2.08 38.79,2.12
S$157
  Bottom 0: 38.79,2.12 38.85,2.16
S$158
  Bottom 0: 38.85,2.16 41.14,4.45
S$159
  Bottom 0: 41.14,4.45 40.99,4.22
S$160
  Bottom 0: 40.99,4.22 40.9,3.9
S$161
  Bottom 0: 40.9,3.9 40.9,3.58
S$162
  Bottom 0: 40.9,3.58 40.99,3.26
S$163
  Bottom 0: 40.99,3.26 41.17,2.99
S$164
  Bottom 0: 41.17,2.99 41.4,2.77
S$165
  Bottom 0: 41.4,2.77 41.69,2.62
S$166
  Bottom 0: 41.69,2.62 42.01,2.55
S$167
  Bottom 0: 42.01,2.55 42.33,2.57
S$168
  Bottom 0: 42.33,2.57 42.64,2.68
S$169
  Bottom 0: 42.64,2.68 42.9,2.87
S$170
  Bottom 0: 42.9,2.87 43.11,3.12
S$171
  Bottom 0: 43.11,3.12 43.24,3.42
S$172
  Bottom 0: 43.24,3.42 43.28,3.74
S$173
  Bottom 0: 43.28,3.74 43.24,4.06
S$174
  Bottom 0: 43.24,4.06 43.11,4.36
S$175
  Bottom 0: 43.11,4.36 42.9,4.62
S$176
  Bottom 0: 42.9,4.62 42.83,4.67
S$177
  Bottom 0: 42.83,4.67 43.15,4.67
S$178
  Bottom 0: 43.15,4.67 43.52,4.3
S$179
  Bottom 0: 43.52,4.3 43.46,4.13
S$180
  Bottom 0: 43.46,4.13 43.46,3.82
S$181
  Bottom 0: 43.46,3.82 43.55,3.53
S$182
  Bottom 0: 43.55,3.53 43.72,3.28
S$183
  Bottom 0: 43.72,3.28 43.96,3.1
S$184
  Bottom 0: 43.96,3.1 44.24,2.98
S$185
  Bottom 0: 44.24,2.98 44.54,2.96
S$186
  Bottom 0: 44.54,2.96 44.84,3.03
S$187
  Bottom 0: 44.84,3.03 45.1,3.18
S$188
  Bottom 0: 45.1,3.18 45.31,3.4
S$189
  Bottom 0: 45.31,3.4 45.44,3.67
S$190
  Bottom 0: 45.44,3.67 45.48,3.98
S$191
  Bottom 0: 45.48,3.98 45.44,4.28
S$192
  Bottom 0: 45.44,4.28 45.31,4.55
S$193
  Bottom 0: 45.31,4.55 45.1,4.77
S$194
  Bottom 0: 45.1,4.77 44.84,4.92
S$195
  Bottom 0: 44.84,4.92 44.54,4.99
S$196
  Bottom 0: 44.54,4.99 44.24,4.97
S$197
  Bottom 0: 44.24,4.97 44.14,4.92
S$198
  Bottom 0: 44.14,4.92 43.84,5.23
S$199
  Bottom 0: 43.84,5.23 54.41,5.23
S$200
  Bottom 0: 54.41,5.23 56.8,2.84
S$201
  Bottom 0: 56.8,2.84 56.85,2.8
S$202
  Bottom 0: 56.85,2.8 56.91,2.76
S$203
  Bottom 0: 56.91,2.76 56.97,2.74
S$204
  Bottom 0: 56.97,2.74 57.04,2.72
S$205
  Bottom 0: 57.04,2.72 57.11,2.71
S$206
  Bottom 0: 57.11,2.71 105.56,2.71
S$207
  Bottom 0: 105.56,2.71 105.64,2.72
S$208
  Bottom 0: 105.64,2.72 105.7,2.74
S$209
  Bottom 0: 105.7,2.74 105.76,2.76
S$210
  Bottom 0: 105.76,2.76 105.82,2.8
S$211
  Bottom 0: 105.82,2.8 105.88,2.84
S$212
  Bottom 0: 105.88,2.84 122.52,19.48
S$213
  Bottom 0: 122.52,19.48 122.58,19.46
S$214
  Bottom 0: 122.58,19.46 122.64,19.44
S$215
  Bottom 0: 122.64,19.44 122.72,19.44
S$216
  Bottom 0: 122.72,19.44 126.24,19.44
S$217
  Bottom 0: 126.24,19.44 126.31,19.44
S$218
  Bottom 0: 126.31,19.44 126.38,19.46
S$219
  Bottom 0: 126.38,19.46 126.44,19.48
S$220
  Bottom 0: 126.44,19.48 126.5,19.52
S$221
  Bottom 0: 126.5,19.52 126.56,19.57
S$222
  Bottom 0: 126.56,19.57 129.8,22.82
S$223
  Bottom 0: 129.8,22.82 129.83,22.8
S$224
  Bottom 0: 129.83,22.8 130.16,22.7
S$225
  Bottom 0: 130.16,22.7 130.51,22.68
S$226
  Bottom 0: 130.51,22.68 130.86,22.74
S$227
  Bottom 0: 130.86,22.74 131.17,22.89
S$228
  Bottom 0: 131.17,22.89 131.44,23.11
S$229
  Bottom 0: 131.44,23.11 131.65,23.4
S$230
  Bottom 0: 131.65,23.4 131.78,23.72
S$231
  Bottom 0: 131.78,23.72 131.82,24.07
S$232
  Bottom 0: 131.82,24.07 131.78,24.41
S$233
  Bottom 0: 131.78,24.41 131.65,24.74
S$234
  Bottom 0: 131.65,24.74 131.44,25.02
S$235
  Bottom 0: 131.44,25.02 131.17,25.25
S$236
  Bottom 0: 131.17,25.25 130.86,25.4
S$237
  Bottom 0: 130.86,25.4 130.51,25.46
S$238
  Bottom 0: 130.51,25.46 130.16,25.44
S$239
  Bottom 0: 130.16,25.44 129.83,25.33
S$240
  Bottom 0: 129.83,25.33 129.54,25.14
S$241
  Bottom 0: 129.54,25.14 129.3,24.89
S$242
  Bottom 0: 129.3,24.89 129.13,24.58
S$243
  Bottom 0: 129.13,24.58 129.04,24.24
S$244
  Bottom 0: 129.04,24.24 129.04,23.89
S$245
  Bottom 0: 129.04,23.89 129.13,23.55
S$246
  Bottom 0: 129.13,23.55 129.18,23.45
S$247
  Bottom 0: 129.18,23.45 126.05,20.32
S$248
  Bottom 0: 126.05,20.32 124.77,20.32
S$249
  Bottom 0: 124.77,20.32 124.82,20.35
S$250
  Bottom 0: 124.82,20.35 125.09,20.57
S$251
  Bottom 0: 125.09,20.57 125.3,20.86
S$252
  Bottom 0: 125.3,20.86 125.42,21.18
S$253
  Bottom 0: 125.42,21.18 125.47,21.53
S$254
  Bottom 0: 125.47,21.53 125.42,21.87
S$255
  Bottom 0: 125.42,21.87 125.3,22.2
S$256
  Bottom 0: 125.3,22.2 125.09,22.48
S$257
  Bottom 0: 125.09,22.48 124.82,22.7
S$258
  Bottom 0: 124.82,22.7 124.51,22.86
S$259
  Bottom 0: 124.51,22.86 124.16,22.92
S$260
  Bottom 0: 124.16,22.92 123.81,22.9
S$261
  Bottom 0: 123.81,22.9 123.48,22.79
S$262
  Bottom 0: 123.48,22.79 123.19,22.6
S$263
  Bottom 0: 123.19,22.6 122.95,22.35
S$264
  Bottom 0: 122.95,22.35 122.78,22.04
S$265
  Bottom 0: 122.78,22.04 122.69,21.7
S$266
  Bottom 0: 122.69,21.7 122.69,21.35
S$267
  Bottom 0: 122.69,21.35 122.78,21.01
S$268
  Bottom 0: 122.78,21.01 122.95,20.7
S$269
  Bottom 0: 122.95,20.7 123.19,20.45
S$270
  Bottom 0: 123.19,20.45 123.39,20.32
S$271
  Bottom 0: 123.39,20.32 122.9,20.32
S$272
  Bottom 0: 122.9,20.32 116.34,26.88
S$273
  Bottom 0: 116.34,26.88 116.34,29.98
S$274
  Bottom 0: 116.34,29.98 116.36,29.96
S$275
  Bottom 0: 116.36,29.96 116.59,29.77
S$276
  Bottom 0: 116.59,29.77 116.87,29.66
S$277
  Bottom 0: 116.87,29.66 117.18,29.64
S$278
  Bottom 0: 117.18,29.64 117.47,29.7
S$279
  Bottom 0: 117.47,29.7 117.68,29.82
S$280
  Bottom 0: 117.68,29.82 135.58,29.82
S$281
  Bottom 0: 135.58,29.82 135.64,29.77
S$282
  Bottom 0: 135.64,29.77 135.92,29.66
S$283
  Bottom 0: 135.92,29.66 136.23,29.64
S$284
  Bottom 0: 136.23,29.64 136.52,29.7
S$285
  Bottom 0: 136.52,29.7 136.79,29.86
S$286
  Bottom 0: 136.79,29.86 136.99,30.08
S$287
  Bottom 0: 136.99,30.08 137.12,30.35
S$288
  Bottom 0: 137.12,30.35 137.17,30.65
S$289
  Bottom 0: 137.17,30.65 137.12,30.95
S$290
  Bottom 0: 137.12,30.95 136.99,31.22
S$291
  Bottom 0: 136.99,31.22 136.85,31.38
S$292
  Bottom 0: 136.85,31.38 137.44,31.38
S$293
  Bottom 0: 137.44,31.38 141.86,26.95
S$294
  Bottom 0: 141.86,26.95 141.86,23.69
S$295
  Bottom 0: 141.86,23.69 134.01,15.84
S$296
  Bottom 0: 134.01,15.84 134.02,15.89
S$297
  Bottom 0: 134.02,15.89 133.97,16.21
S$298
  Bottom 0: 133.97,16.21 133.84,16.51
S$299
  Bottom 0: 133.84,16.51 133.64,16.76
S$300
  Bottom 0: 133.64,16.76 133.37,16.95
S$301
  Bottom 0: 133.37,16.95 133.07,17.06
S$302
  Bottom 0: 133.07,17.06 132.74,17.08
S$303
  Bottom 0: 132.74,17.08 132.42,17.01
S$304
  Bottom 0: 132.42,17.01 132.13,16.86
S$305
  Bottom 0: 132.13,16.86 131.9,16.64
S$306
  Bottom 0: 131.9,16.64 131.73,16.36
S$307
  Bottom 0: 131.73,16.36 131.64,16.05
S$308
  Bottom 0: 131.64,16.05 131.64,15.72
S$309
  Bottom 0: 131.64,15.72 131.73,15.41
S$310
  Bottom 0: 131.73,15.41 131.9,15.14
S$311
  Bottom 0: 131.9,15.14 132.13,14.91
S$312
  Bottom 0: 132.13,14.91 132.42,14.77
S$313
  Bottom 0: 132.42,14.77 132.74,14.7
S$314
  Bottom 0: 132.74,14.7 132.88,14.71
S$315
  Bottom 0: 132.88,14.71 131.38,13.21
S$316
  Bottom 0: 131.38,13.21 131.26,13.21
S$317
  Bottom 0: 131.26,13.21 131.23,13.26
S$318
  Bottom 0: 131.23,13.26 131.02,13.5
S$319
  Bottom 0: 131.02,13.5 130.75,13.68
S$320
  Bottom 0: 130.75,13.68 130.44,13.77
S$321
  Bottom 0: 130.44,13.77 130.11,13.77
S$322
  Bottom 0: 130.11,13.77 129.8,13.68
S$323
  Bottom 0: 129.8,13.68 129.53,13.5
S$324
  Bottom 0: 129.53,13.5 129.31,13.26
S$325
  Bottom 0: 129.31,13.26 129.18,12.96
S$326
  Bottom 0: 129.18,12.96 129.13,12.64
S$327
  Bottom 0: 129.13,12.64 129.18,12.32
S$328
  Bottom 0: 129.18,12.32 129.31,12.02
S$329
  Bottom 0: 129.31,12.02 129.53,11.77
S$330
  Bottom 0: 129.53,11.77 129.8,11.6
S$331
  Bottom 0: 129.8,11.6 130.11,11.5
S$332
  Bottom 0: 130.11,11.5 130.44,11.5
S$333
  Bottom 0: 130.44,11.5 130.75,11.6
S$334
  Bottom 0: 130.75,11.6 131.02,11.77
S$335
  Bottom 0: 131.02,11.77 131.23,12.02
S$336
  Bottom 0: 131.23,12.02 131.26,12.07
S$337
  Bottom 0: 131.26,12.07 131.61,12.07
S$338
  Bottom 0: 131.61,12.07 131.71,12.07
S$339
  Bottom 0: 131.71,12.07 131.79,12.09
S$340
  Bottom 0: 131.79,12.09 131.87,12.13
S$341
  Bottom 0: 131.87,12.13 131.95,12.17
S$342
  Bottom 0: 131.95,12.17 132.02,12.23
S$343
  Bottom 0: 132.02,12.23 141.84,22.05
S$344
  Bottom 0: 141.84,22.05 141.83,22.04
S$345
  Bottom 0: 141.83,22.04 141.74,21.7
S$346
  Bottom 0: 141.74,21.7 141.74,21.35
S$347
  Bottom 0: 141.74,21.35 141.83,21.01
S$348
  Bottom 0: 141.83,21.01 142,20.7
S$349
  Bottom 0: 142,20.7 142.24,20.45
S$350
  Bottom 0: 142.24,20.45 142.53,20.26
S$351
  Bottom 0: 142.53,20.26 142.86,20.16
S$352
  Bottom 0: 142.86,20.16 143.21,20.14
S$353
  Bottom 0: 143.21,20.14 143.56,20.2
S$354
  Bottom 0: 143.56,20.2 143.87,20.35
S$355
  Bottom 0: 143.87,20.35 144.14,20.57
S$356
  Bottom 0: 144.14,20.57 144.35,20.86
S$357
  Bottom 0: 144.35,20.86 144.47,21.18
S$358
  Bottom 0: 144.47,21.18 144.52,21.53
S$359
  Bottom 0: 144.52,21.53 144.47,21.87
S$360
  Bottom 0: 144.47,21.87 144.35,22.2
S$361
  Bottom 0: 144.35,22.2 144.14,22.48
S$362
  Bottom 0: 144.14,22.48 143.87,22.7
S$363
  Bottom 0: 143.87,22.7 143.56,22.86
S$364
  Bottom 0: 143.56,22.86 143.21,22.92
S$365
  Bottom 0: 143.21,22.92 142.86,22.9
S$366
  Bottom 0: 142.86,22.9 142.59,22.81
S$367
  Bottom 0: 142.59,22.81 142.83,23.05
S$368
  Bottom 0: 142.83,23.05 142.89,23.12
S$369
  Bottom 0: 142.89,23.12 142.94,23.19
S$370
  Bottom 0: 142.94,23.19 142.97,23.27
S$371
  Bottom 0: 142.97,23.27 142.99,23.36
S$372
  Bottom 0: 142.99,23.36 143,23.45
S$373
  Bottom 0: 143,23.45 143,26.95
S$374
  Bottom 0: 143,26.95 143.58,27.53
S$375
  Bottom 0: 143.58,27.53 143.55,27.48
S$376
  Bottom 0: 143.55,27.48 143.42,27.05
S$377
  Bottom 0: 143.42,27.05 143.38,26.61
S$378
  Bottom 0: 143.38,26.61 143.42,26.16
S$379
  Bottom 0: 143.42,26.16 143.55,25.73
S$380
  Bottom 0: 143.55,25.73 143.77,25.34
S$381
  Bottom 0: 143.77,25.34 144.05,24.99
S$382
  Bottom 0: 144.05,24.99 144.4,24.71
S$383
  Bottom 0: 144.4,24.71 144.79,24.49
S$384
  Bottom 0: 144.79,24.49 145.22,24.37
S$385
  Bottom 0: 145.22,24.37 145.67,24.32
S$386
  Bottom 0: 145.67,24.32 146.11,24.37
S$387
  Bottom 0: 146.11,24.37 146.54,24.49
S$388
  Bottom 0: 146.54,24.49 146.94,24.71
S$389
  Bottom 0: 146.94,24.71 147.28,24.99
S$390
  Bottom 0: 147.28,24.99 147.41,25.14
S$391
  Bottom 0: 147.41,25.14 147.41,20.24
S$392
  Bottom 0: 147.41,20.24 147.38,20.22
S$393
  Bottom 0: 147.38,20.22 133.43,6.26
S$394
  Bottom 0: 133.43,6.26 133.25,6.35
S$395
  Bottom 0: 133.25,6.35 132.9,6.41
S$396
  Bottom 0: 132.9,6.41 132.55,6.39
S$397
  Bottom 0: 132.55,6.39 132.22,6.28
S$398
  Bottom 0: 132.22,6.28 131.93,6.09
S$399
  Bottom 0: 131.93,6.09 131.69,5.84
S$400
  Bottom 0: 131.69,5.84 131.51,5.53
S$401
  Bottom 0: 131.51,5.53 131.43,5.19
S$402
  Bottom 0: 131.43,5.19 131.43,4.84
S$403
  Bottom 0: 131.43,4.84 131.51,4.5
S$404
  Bottom 0: 131.51,4.5 131.69,4.19
S$405
  Bottom 0: 131.69,4.19 131.93,3.94
S$406
  Bottom 0: 131.93,3.94 132.22,3.75
S$407
  Bottom 0: 132.22,3.75 132.55,3.65
S$408
  Bottom 0: 132.55,3.65 132.9,3.62
S$409
  Bottom 0: 132.9,3.62 133.25,3.69
S$410
  Bottom 0: 133.25,3.69 133.56,3.84
S$411
  Bottom 0: 133.56,3.84 133.83,4.06
S$412
  Bottom 0: 133.83,4.06 134.04,4.35
S$413
  Bottom 0: 134.04,4.35 134.16,4.67
S$414
  Bottom 0: 134.16,4.67 134.21,5.02
S$415
  Bottom 0: 134.21,5.02 134.16,5.36
S$416
  Bottom 0: 134.16,5.36 134.06,5.63
S$417
  Bottom 0: 134.06,5.63 147.88,19.46
S$418
  Bottom 0: 147.88,19.46 164.36,19.46
S$419
  Bottom 0: 164.36,19.46 164.43,19.46
S$420
  Bottom 0: 164.43,19.46 164.5,19.48
S$421
  Bottom 0: 164.5,19.48 164.56,19.5
S$422
  Bottom 0: 164.56,19.5 164.62,19.55
S$423
  Bottom 0: 164.62,19.55 164.68,19.59
S$424
  Bottom 0: 164.68,19.59 167.91,22.82
S$425
  Bottom 0: 167.91,22.82 167.93,22.8
S$426
  Bottom 0: 167.93,22.8 168.26,22.7
S$427
  Bottom 0: 168.26,22.7 168.61,22.68
S$428
  Bottom 0: 168.61,22.68 168.96,22.74
S$429
  Bottom 0: 168.96,22.74 169.27,22.89
S$430
  Bottom 0: 169.27,22.89 169.54,23.11
S$431
  Bottom 0: 169.54,23.11 169.72,23.36
S$432
  Bottom 0: 169.72,23.36 169.72,14.76
S$433
  Bottom 0: 169.72,14.76 167.57,12.6
S$434
  Bottom 0: 167.57,12.6 167.7,12.91
S$435
  Bottom 0: 167.7,12.91 167.83,13.4
S$436
  Bottom 0: 167.83,13.4 167.87,13.92
S$437
  Bottom 0: 167.87,13.92 167.83,14.44
S$438
  Bottom 0: 167.83,14.44 167.7,14.94
S$439
  Bottom 0: 167.7,14.94 167.5,15.41
S$440
  Bottom 0: 167.5,15.41 167.21,15.85
S$441
  Bottom 0: 167.21,15.85 166.86,16.23
S$442
  Bottom 0: 166.86,16.23 166.45,16.55
S$443
  Bottom 0: 166.45,16.55 166,16.79
S$444
  Bottom 0: 166,16.79 165.5,16.96
S$445
  Bottom 0: 165.5,16.96 165,17.05
S$446
  Bottom 0: 165,17.05 164.47,17.05
S$447
  Bottom 0: 164.47,17.05 163.97,16.96
S$448
  Bottom 0: 163.97,16.96 163.48,16.79
S$449
  Bottom 0: 163.48,16.79 163.03,16.55
S$450
  Bottom 0: 163.03,16.55 162.61,16.23
S$451
  Bottom 0: 162.61,16.23 162.26,15.85
S$452
  Bottom 0: 162.26,15.85 161.98,15.41
S$453
  Bottom 0: 161.98,15.41 161.77,14.94
S$454
  Bottom 0: 161.77,14.94 161.64,14.44
S$455
  Bottom 0: 161.64,14.44 161.6,13.92
S$456
  Bottom 0: 161.6,13.92 161.64,13.4
S$457
  Bottom 0: 161.64,13.4 161.77,12.91
S$458
  Bottom 0: 161.77,12.91 161.98,12.43
S$459
  Bottom 0: 161.98,12.43 162.26,12
S$460
  Bottom 0: 162.26,12 162.61,11.62
S$461
  Bottom 0: 162.61,11.62 163.03,11.29
S$462
  Bottom 0: 163.03,11.29 163.48,11.05
S$463
  Bottom 0: 163.48,11.05 163.97,10.88
S$464
  Bottom 0: 163.97,10.88 164.47,10.8
S$465
  Bottom 0: 164.47,10.8 165,10.8
S$466
  Bottom 0: 165,10.8 165.5,10.88
S$467
  Bottom 0: 165.5,10.88 166,11.05
S$468
  Bottom 0: 166,11.05 166.05,11.08
S$469
  Bottom 0: 166.05,11.08 163.65,8.68
S$470
  Bottom 0: 163.65,8.68 163.39,8.7
S$471
  Bottom 0: 163.39,8.7 163.06,8.63
S$472
  Bottom 0: 163.06,8.63 162.78,8.49
S$473
  Bottom 0: 162.78,8.49 162.54,8.26
S$474
  Bottom 0: 162.54,8.26 162.37,7.99
S$475
  Bottom 0: 162.37,7.99 162.28,7.67
S$476
  Bottom 0: 162.28,7.67 162.28,7.35
S$477
  Bottom 0: 162.28,7.35 162.37,7.03
S$478
  Bottom 0: 162.37,7.03 162.54,6.76
S$479
  Bottom 0: 162.54,6.76 162.78,6.54
S$480
  Bottom 0: 162.78,6.54 163.06,6.39
S$481
  Bottom 0: 163.06,6.39 163.39,6.32
S$482
  Bottom 0: 163.39,6.32 163.71,6.34
S$483
  Bottom 0: 163.71,6.34 164.01,6.45
S$484
  Bottom 0: 164.01,6.45 164.28,6.64
S$485
  Bottom 0: 164.28,6.64 164.49,6.89
S$486
  Bottom 0: 164.49,6.89 164.62,7.19
S$487
  Bottom 0: 164.62,7.19 164.66,7.51
S$488
  Bottom 0: 164.66,7.51 164.62,7.83
S$489
  Bottom 0: 164.62,7.83 164.55,7.98
S$490
  Bottom 0: 164.55,7.98 164.81,8.23
S$491
  Bottom 0: 164.81,8.23 164.81,6.57
S$492
  Bottom 0: 164.81,6.57 164.82,6.5
S$493
  Bottom 0: 164.82,6.5 164.86,6.42
S$494
  Bottom 0: 164.86,6.42 164.91,6.37
S$495
  Bottom 0: 164.91,6.37 164.98,6.33
S$496
  Bottom 0: 164.98,6.33 165.06,6.32
S$497
  Bottom 0: 165.06,6.32 166.94,6.32
S$498
  Bottom 0: 166.94,6.32 167.02,6.33
S$499
  Bottom 0: 167.02,6.33 167.09,6.37
S$500
  Bottom 0: 167.09,6.37 167.15,6.42
S$501
  Bottom 0: 167.15,6.42 167.19,6.5
S$502
  Bottom 0: 167.19,6.5 167.2,6.57
S$503
  Bottom 0: 167.2,6.57 167.2,8.45
S$504
  Bottom 0: 167.2,8.45 167.19,8.53
S$505
  Bottom 0: 167.19,8.53 167.15,8.6
S$506
  Bottom 0: 167.15,8.6 167.09,8.65
S$507
  Bottom 0: 167.09,8.65 167.02,8.69
S$508
  Bottom 0: 167.02,8.69 166.94,8.71
S$509
  Bottom 0: 166.94,8.71 165.28,8.71
S$510
  Bottom 0: 165.28,8.71 170.7,14.12
S$511
  Bottom 0: 170.7,14.12 170.76,14.19
S$512
  Bottom 0: 170.76,14.19 170.8,14.26
S$513
  Bottom 0: 170.8,14.26 170.84,14.34
S$514
  Bottom 0: 170.84,14.34 170.86,14.43
S$515
  Bottom 0: 170.86,14.43 170.86,14.52
S$516
  Bottom 0: 170.86,14.52 170.86,26.81
S$517
  Bottom 0: 170.86,26.81 173.5,26.81
S$518
  Bottom 0: 173.5,26.81 173.59,26.82
S$519
  Bottom 0: 173.59,26.82 173.68,26.84
S$520
  Bottom 0: 173.68,26.84 173.76,26.87
S$521
  Bottom 0: 173.76,26.87 173.84,26.92
S$522
  Bottom 0: 173.84,26.92 173.9,26.98
S$523
  Bottom 0: 173.9,26.98 177.1,30.18
S$524
  Bottom 0: 177.1,30.18 177.26,30.22
S$525
  Bottom 0: 177.26,30.22 177.41,30.33
S$526
  Bottom 0: 177.41,30.33 177.41,8.55
S$527
  Bottom 0: 177.41,8.55 177.28,8.49
S$528
  Bottom 0: 177.28,8.49 177.05,8.26
S$529
  Bottom 0: 177.05,8.26 176.88,7.99
S$530
  Bottom 0: 176.88,7.99 176.79,7.67
S$531
  Bottom 0: 176.79,7.67 176.79,7.35
S$532
  Bottom 0: 176.79,7.35 176.88,7.03
S$533
  Bottom 0: 176.88,7.03 177.05,6.76
S$534
  Bottom 0: 177.05,6.76 177.28,6.54
S$535
  Bottom 0: 177.28,6.54 177.57,6.39
S$536
  Bottom 0: 177.57,6.39 177.89,6.32
S$537
  Bottom 0: 177.89,6.32 178.22,6.34
S$538
  Bottom 0: 178.22,6.34 178.52,6.45
S$539
  Bottom 0: 178.52,6.45 178.79,6.64
S$540
  Bottom 0: 178.79,6.64 179,6.89
S$541
  Bottom 0: 179,6.89 179.12,7.19
S$542
  Bottom 0: 179.12,7.19 179.17,7.51
S$543
  Bottom 0: 179.17,7.51 179.12,7.83
S$544
  Bottom 0: 179.12,7.83 179,8.13
S$545
  Bottom 0: 179,8.13 178.79,8.38
S$546
  Bottom 0: 178.79,8.38 178.54,8.56
S$547
  Bottom 0: 178.54,8.56 178.54,32.64
S$548
  Bottom 0: 178.54,32.64 178.64,32.74
S$549
  Bottom 0: 178.64,32.74 181.42,32.74
S$550
  Bottom 0: 181.42,32.74 181.4,32.72
S$551
  Bottom 0: 181.4,32.72 181.36,32.65
S$552
  Bottom 0: 181.36,32.65 181.35,32.58
S$553
  Bottom 0: 181.35,32.58 181.35,30.8
S$554
  Bottom 0: 181.35,30.8 181.36,30.72
S$555
  Bottom 0: 181.36,30.72 181.4,30.65
S$556
  Bottom 0: 181.4,30.65 181.46,30.59
S$557
  Bottom 0: 181.46,30.59 181.53,30.55
S$558
  Bottom 0: 181.53,30.55 181.61,30.54
S$559
  Bottom 0: 181.61,30.54 183.38,30.54
S$560
  Bottom 0: 183.38,30.54 183.46,30.55
S$561
  Bottom 0: 183.46,30.55 183.53,30.59
S$562
  Bottom 0: 183.53,30.59 183.59,30.65
S$563
  Bottom 0: 183.59,30.65 183.63,30.72
S$564
  Bottom 0: 183.63,30.72 183.64,30.8
S$565
  Bottom 0: 183.64,30.8 183.64,32.58
S$566
  Bottom 0: 183.64,32.58 183.63,32.65
S$567
  Bottom 0: 183.63,32.65 183.59,32.72
S$568
  Bottom 0: 183.59,32.72 183.57,32.74
S$569
  Bottom 0: 183.57,32.74 184.6,32.74
S$570
  Bottom 0: 184.6,32.74 184.56,32.73
S$571
  Bottom 0: 184.56,32.73 184.29,32.55
S$572
  Bottom 0: 184.29,32.55 184.08,32.31
S$573
  Bottom 0: 184.08,32.31 183.94,32.01
S$574
  Bottom 0: 183.94,32.01 183.89,31.69
S$575
  Bottom 0: 183.89,31.69 183.94,31.37
S$576
  Bottom 0: 183.94,31.37 184.08,31.07
S$577
  Bottom 0: 184.08,31.07 184.29,30.82
S$578
  Bottom 0: 184.29,30.82 184.56,30.64
S$579
  Bottom 0: 184.56,30.64 184.87,30.55
S$580
  Bottom 0: 184.87,30.55 185.2,30.55
S$581
  Bottom 0: 185.2,30.55 185.51,30.64
S$582
  Bottom 0: 185.51,30.64 185.78,30.82
S$583
  Bottom 0: 185.78,30.82 186,31.07
S$584
  Bottom 0: 186,31.07 186.02,31.12
S$585
  Bottom 0: 186.02,31.12 192.41,31.12
S$586
  Bottom 0: 192.41,31.12 192.39,31.09
S$587
  Bottom 0: 192.39,31.09 191.89,31.09
S$588
  Bottom 0: 191.89,31.09 191.82,31.09
S$589
  Bottom 0: 191.82,31.09 191.75,31.07
S$590
  Bottom 0: 191.75,31.07 191.69,31.05
S$591
  Bottom 0: 191.69,31.05 191.63,31.01
S$592
  Bottom 0: 191.63,31.01 191.57,30.96
S$593
  Bottom 0: 191.57,30.96 185.38,24.77
S$594
  Bottom 0: 185.38,24.77 185.34,24.71
S$595
  Bottom 0: 185.34,24.71 185.3,24.65
S$596
  Bottom 0: 185.3,24.65 185.27,24.59
S$597
  Bottom 0: 185.27,24.59 185.25,24.52
S$598
  Bottom 0: 185.25,24.52 185.25,24.45
S$599
  Bottom 0: 185.25,24.45 185.25,16.78
S$600
  Bottom 0: 185.25,16.78 185.18,16.76
S$601
  Bottom 0: 185.18,16.76 184.94,16.57
S$602
  Bottom 0: 184.94,16.57 184.78,16.32
S$603
  Bottom 0: 184.78,16.32 184.68,16.03
S$604
  Bottom 0: 184.68,16.03 184.68,15.72
S$605
  Bottom 0: 184.68,15.72 184.78,15.44
S$606
  Bottom 0: 184.78,15.44 184.94,15.19
S$607
  Bottom 0: 184.94,15.19 185.18,15
S$608
  Bottom 0: 185.18,15 185.46,14.89
S$609
  Bottom 0: 185.46,14.89 185.76,14.87
S$610
  Bottom 0: 185.76,14.87 186.06,14.93
S$611
  Bottom 0: 186.06,14.93 186.33,15.09
S$612
  Bottom 0: 186.33,15.09 186.53,15.3
S$613
  Bottom 0: 186.53,15.3 186.66,15.58
S$614
  Bottom 0: 186.66,15.58 186.71,15.88
S$615
  Bottom 0: 186.71,15.88 186.66,16.18
S$616
  Bottom 0: 186.66,16.18 186.53,16.45
S$617
  Bottom 0: 186.53,16.45 186.33,16.67
S$618
  Bottom 0: 186.33,16.67 186.13,16.78
S$619
  Bottom 0: 186.13,16.78 186.13,24.27
S$620
  Bottom 0: 186.13,24.27 186.22,24.35
S$621
  Bottom 0: 186.22,24.35 186.19,24.24
S$622
  Bottom 0: 186.19,24.24 186.19,23.89
S$623
  Bottom 0: 186.19,23.89 186.27,23.55
S$624
  Bottom 0: 186.27,23.55 186.45,23.24
S$625
  Bottom 0: 186.45,23.24 186.69,22.99
S$626
  Bottom 0: 186.69,22.99 186.98,22.8
S$627
  Bottom 0: 186.98,22.8 187.31,22.7
S$628
  Bottom 0: 187.31,22.7 187.66,22.68
S$629
  Bottom 0: 187.66,22.68 188.01,22.74
S$630
  Bottom 0: 188.01,22.74 188.2,22.83
S$631
  Bottom 0: 188.2,22.83 191.88,19.14
S$632
  Bottom 0: 191.88,19.14 191.94,19.1
S$633
  Bottom 0: 191.94,19.1 192,19.06
S$634
  Bottom 0: 192,19.06 192.06,19.03
S$635
  Bottom 0: 192.06,19.03 192.12,19.02
S$636
  Bottom 0: 192.12,19.02 192.19,19.01
S$637
  Bottom 0: 192.19,19.01 196.56,19.01
S$638
  Bottom 0: 196.56,19.01 201.81,13.77
S$639
  Bottom 0: 201.81,13.77 201.55,13.77
S$640
  Bottom 0: 201.55,13.77 201.24,13.68
S$641
  Bottom 0: 201.24,13.68 200.96,13.5
S$642
  Bottom 0: 200.96,13.5 200.75,13.26
S$643
  Bottom 0: 200.75,13.26 200.61,12.96
S$644
  Bottom 0: 200.61,12.96 200.57,12.64
S$645
  Bottom 0: 200.57,12.64 200.61,12.32
S$646
  Bottom 0: 200.61,12.32 200.75,12.02
S$647
  Bottom 0: 200.75,12.02 200.96,11.77
S$648
  Bottom 0: 200.96,11.77 201.24,11.6
S$649
  Bottom 0: 201.24,11.6 201.55,11.5
S$650
  Bottom 0: 201.55,11.5 201.87,11.5
S$651
  Bottom 0: 201.87,11.5 202.18,11.6
S$652
  Bottom 0: 202.18,11.6 202.46,11.77
S$653
  Bottom 0: 202.46,11.77 202.67,12.02
S$654
  Bottom 0: 202.67,12.02 202.81,12.32
S$655
  Bottom 0: 202.81,12.32 202.85,12.64
S$656
  Bottom 0: 202.85,12.64 202.84,12.74
S$657
  Bottom 0: 202.84,12.74 203.81,11.77
S$658
  Bottom 0: 203.81,11.77 203.81,6.33
S$659
  Bottom 0: 203.81,6.33 203.66,6.28
S$660
  Bottom 0: 203.66,6.28 203.36,6.09
S$661
  Bottom 0: 203.36,6.09 203.12,5.84
S$662
  Bottom 0: 203.12,5.84 202.95,5.53
S$663
  Bottom 0: 202.95,5.53 202.86,5.19
S$664
  Bottom 0: 202.86,5.19 202.86,4.84
S$665
  Bottom 0: 202.86,4.84 202.95,4.5
S$666
  Bottom 0: 202.95,4.5 203.12,4.19
S$667
  Bottom 0: 203.12,4.19 203.36,3.94
S$668
  Bottom 0: 203.36,3.94 203.66,3.75
S$669
  Bottom 0: 203.66,3.75 203.98,3.65
S$670
  Bottom 0: 203.98,3.65 204.34,3.62
S$671
  Bottom 0: 204.34,3.62 204.68,3.69
S$672
  Bottom 0: 204.68,3.69 204.86,3.77
S$673
  Bottom 0: 204.86,3.77 206.13,2.51
S$674
  Bottom 0: 206.13,2.51 206.19,2.47
S$675
  Bottom 0: 206.19,2.47 206.25,2.43
S$676
  Bottom 0: 206.25,2.43 206.31,2.4
S$677
  Bottom 0: 206.31,2.4 206.37,2.38
S$678
  Bottom 0: 206.37,2.38 206.44,2.38
S$679
  Bottom 0: 206.44,2.38 215.8,2.38
S$680
  Bottom 0: 215.8,2.38 215.87,2.38
S$681
  Bottom 0: 215.87,2.38 215.94,2.4
S$682
  Bottom 0: 215.94,2.4 216,2.43
S$683
  Bottom 0: 216,2.43 216.06,2.47
S$684
  Bottom 0: 216.06,2.47 216.11,2.51
S$685
  Bottom 0: 216.11,2.51 217.23,3.63
S$686
  Bottom 0: 217.23,3.63 220.94,3.63
S$687
  Bottom 0: 220.94,3.63 220.82,3.55
S$688
  Bottom 0: 220.82,3.55 220.58,3.3
S$689
  Bottom 0: 220.58,3.3 220.41,2.99
S$690
  Bottom 0: 220.41,2.99 220.32,2.65
S$691
  Bottom 0: 220.32,2.65 220.32,2.3
S$692
  Bottom 0: 220.32,2.3 220.41,1.96
S$693
  Bottom 0: 220.41,1.96 220.58,1.65
S$694
  Bottom 0: 220.58,1.65 220.82,1.4
S$695
  Bottom 0: 220.82,1.4 221.12,1.21
S$696
  Bottom 0: 221.12,1.21 221.44,1.1
S$697
  Bottom 0: 221.44,1.1 221.79,1.08
S$698
  Bottom 0: 221.79,1.08 222.14,1.15
S$699
  Bottom 0: 222.14,1.15 222.46,1.3
S$700
  Bottom 0: 222.46,1.3 222.72,1.52
S$701
  Bottom 0: 222.72,1.52 222.93,1.81
S$702
  Bottom 0: 222.93,1.81 223.06,2.13
S$703
  Bottom 0: 223.06,2.13 223.1,2.48
S$704
  Bottom 0: 223.1,2.48 223.06,2.82
S$705
  Bottom 0: 223.06,2.82 222.93,3.15
S$706
  Bottom 0: 222.93,3.15 222.72,3.43
S$707
  Bottom 0: 222.72,3.43 222.49,3.63
S$708
  Bottom 0: 222.49,3.63 224.15,3.63
S$709
  Bottom 0: 224.15,3.63 224.66,3.12
S$710
  Bottom 0: 224.66,3.12 224.72,3.08
S$711
  Bottom 0: 224.72,3.08 224.78,3.04
S$712
  Bottom 0: 224.78,3.04 224.84,3.02
S$713
  Bottom 0: 224.84,3.02 224.9,3
S$714
  Bottom 0: 224.9,3 224.97,3
S$715
  Bottom 0: 224.97,3 228.62,3
S$716
  Bottom 0: 228.62,3 228.69,3
S$717
  Bottom 0: 228.69,3 228.75,3.02
S$718
  Bottom 0: 228.75,3.02 228.81,3.04
S$719
  Bottom 0: 228.81,3.04 228.87,3.08
S$720
  Bottom 0: 228.87,3.08 228.93,3.12
S$721
  Bottom 0: 228.93,3.12 237.55,11.74
S$722
  Bottom 0: 237.55,11.74 237.55,11.44
S$723
  Bottom 0: 237.55,11.44 237.64,11.15
S$724
  Bottom 0: 237.64,11.15 237.81,10.9
S$725
  Bottom 0: 237.81,10.9 238.05,10.72
S$726
  Bottom 0: 238.05,10.72 238.33,10.6
S$727
  Bottom 0: 238.33,10.6 238.64,10.58
S$728
  Bottom 0: 238.64,10.58 238.88,10.64
S$729
  Bottom 0: 238.88,10.64 245.67,3.86
S$730
  Bottom 0: 245.67,3.86 245.61,3.87
S$731
  Bottom 0: 245.61,3.87 245.26,3.85
S$732
  Bottom 0: 245.26,3.85 244.93,3.74
S$733
  Bottom 0: 244.93,3.74 244.9,3.73
S$734
  Bottom 0: 244.9,3.73 244.34,4.29
S$735
  Bottom 0: 244.34,4.29 244.28,4.33
S$736
  Bottom 0: 244.28,4.33 244.22,4.37
S$737
  Bottom 0: 244.22,4.37 244.16,4.4
S$738
  Bottom 0: 244.16,4.4 244.1,4.41
S$739
  Bottom 0: 244.1,4.41 244.03,4.42
S$740
  Bottom 0: 244.03,4.42 239.46,4.42
S$741
  Bottom 0: 239.46,4.42 239.4,4.55
S$742
  Bottom 0: 239.4,4.55 239.19,4.77
S$743
  Bottom 0: 239.19,4.77 238.93,4.92
S$744
  Bottom 0: 238.93,4.92 238.64,4.99
S$745
  Bottom 0: 238.64,4.99 238.33,4.97
S$746
  Bottom 0: 238.33,4.97 238.05,4.85
S$747
  Bottom 0: 238.05,4.85 237.81,4.67
S$748
  Bottom 0: 237.81,4.67 237.64,4.42
S$749
  Bottom 0: 237.64,4.42 237.55,4.13
S$750
  Bottom 0: 237.55,4.13 237.55,3.82
S$751
  Bottom 0: 237.55,3.82 237.64,3.53
S$752
  Bottom 0: 237.64,3.53 237.81,3.28
S$753
  Bottom 0: 237.81,3.28 238.05,3.1
S$754
  Bottom 0: 238.05,3.1 238.33,2.98
S$755
  Bottom 0: 238.33,2.98 238.64,2.96
S$756
  Bottom 0: 238.64,2.96 238.93,3.03
S$757
  Bottom 0: 238.93,3.03 239.19,3.18
S$758
  Bottom 0: 239.19,3.18 239.4,3.4
S$759
  Bottom 0: 239.4,3.4 239.46,3.53
S$760
  Bottom 0: 239.46,3.53 243.84,3.53
S$761
  Bottom 0: 243.84,3.53 244.28,3.09
S$762
  Bottom 0: 244.28,3.09 244.22,2.99
S$763
  Bottom 0: 244.22,2.99 244.14,2.65
S$764
  Bottom 0: 244.14,2.65 244.14,2.3
S$765
  Bottom 0: 244.14,2.3 244.22,1.96
S$766
  Bottom 0: 244.22,1.96 244.4,1.65
S$767
  Bottom 0: 244.4,1.65 244.63,1.4
S$768
  Bottom 0: 244.63,1.4 244.93,1.21
S$769
  Bottom 0: 244.93,1.21 245.26,1.1
S$770
  Bottom 0: 245.26,1.1 245.61,1.08
S$771
  Bottom 0: 245.61,1.08 245.96,1.15
S$772
  Bottom 0: 245.96,1.15 246.27,1.3
S$773
  Bottom 0: 246.27,1.3 246.54,1.52
S$774
  Bottom 0: 246.54,1.52 246.75,1.81
S$775
  Bottom 0: 246.75,1.81 246.88,2.13
S$776
  Bottom 0: 246.88,2.13 246.92,2.48
S$777
  Bottom 0: 246.92,2.48 246.88,2.82